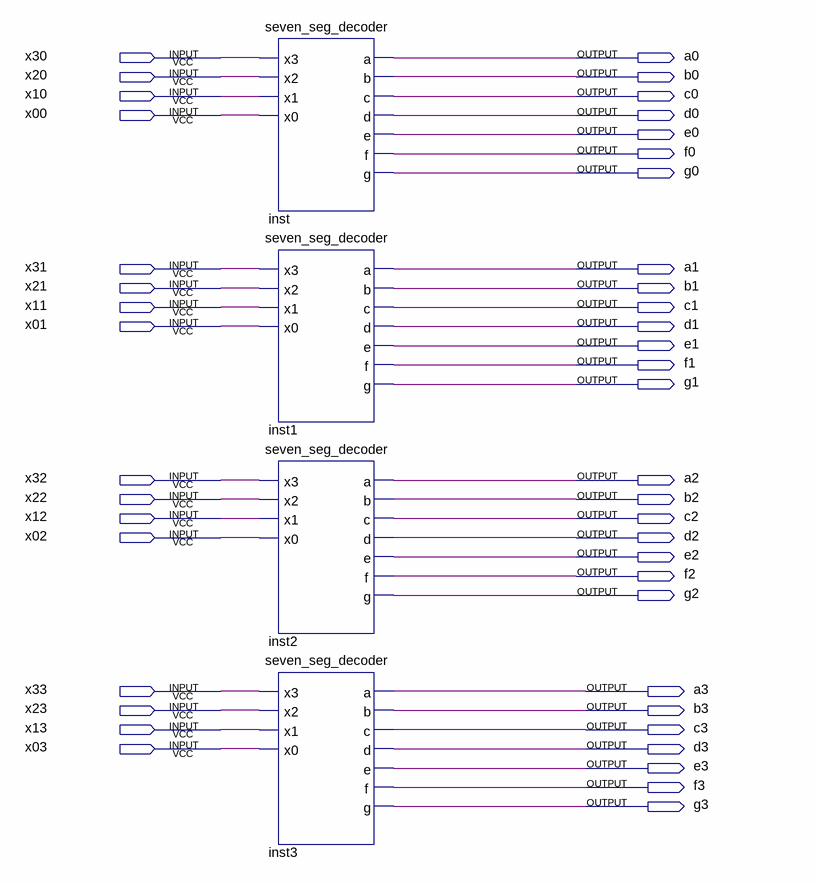
[diagram p0: schematic sheet]
// Quartus schematic lab5step1.bdf as structural Verilog: 4 symbols, 44 pins
module lab5step1 (
  input  x30,
  input  x20,
  input  x10,
  input  x00,
  input  x31,
  input  x21,
  input  x11,
  input  x01,
  input  x32,
  input  x22,
  input  x12,
  input  x02,
  input  x33,
  input  x23,
  input  x13,
  input  x03,
  output a0,
  output b0,
  output c0,
  output d0,
  output e0,
  output f0,
  output g0,
  output a1,
  output b1,
  output c1,
  output d1,
  output e1,
  output f1,
  output g1,
  output a2,
  output b2,
  output c2,
  output d2,
  output e2,
  output f2,
  output g2,
  output a3,
  output b3,
  output c3,
  output d3,
  output e3,
  output f3,
  output g3
);

  seven_seg_decoder inst (
    .x3(x30), .x2(x20), .x1(x10), .x0(x00), .a(a0), .b(b0), .c(c0), .d(d0), .e(e0), .f(f0), .g(g0));
  seven_seg_decoder inst1 (
    .x3(x31), .x2(x21), .x1(x11), .x0(x01), .a(a1), .b(b1), .c(c1), .d(d1), .e(e1), .f(f1), .g(g1));
  seven_seg_decoder inst2 (
    .x3(x32), .x2(x22), .x1(x12), .x0(x02), .a(a2), .b(b2), .c(c2), .d(d2), .e(e2), .f(f2), .g(g2));
  seven_seg_decoder inst3 (
    .x3(x33), .x2(x23), .x1(x13), .x0(x03), .a(a3), .b(b3), .c(c3), .d(d3), .e(e3), .f(f3), .g(g3));
endmodule
